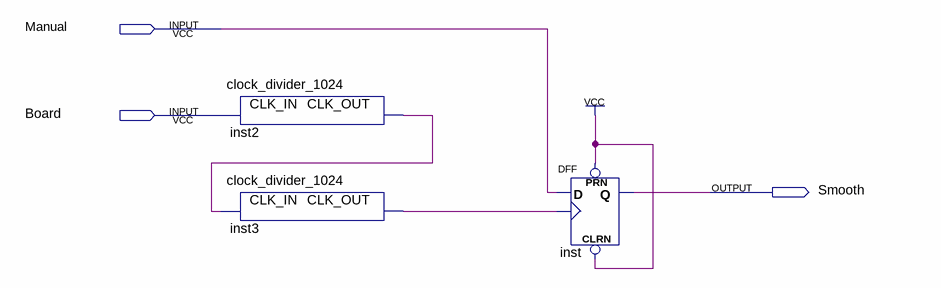
[diagram p0: schematic sheet]
// Quartus schematic Lab11step3.bdf as structural Verilog: 3 symbols, 3 pins
module Lab11step3 (
  input  Manual,
  input  Board,
  output Smooth
);

  wire inst2_clk_out, inst3_clk_out;

  clock_divider_1024 inst2 (.CLK_IN(Board), .CLK_OUT(inst2_clk_out));
  clock_divider_1024 inst3 (.CLK_IN(inst2_clk_out), .CLK_OUT(inst3_clk_out));
  DFF inst (.CLRN(1'b1), .CLK(inst3_clk_out), .D(Manual), .PRN(1'b1), .Q(Smooth));
endmodule
